# EasyEDA Pro project 1比87系列主控小板.epro

# Schematic 1比87系列主控小板
Create Date: 2023-08-22; Page Name: P1; Project Name: 遥控小车驱动小板; Schematic Name: 1比87系列主控小板; Update Date: 2023-08-26; Company: 嘉立创EDA; Page Size: A4; Version: V1.0
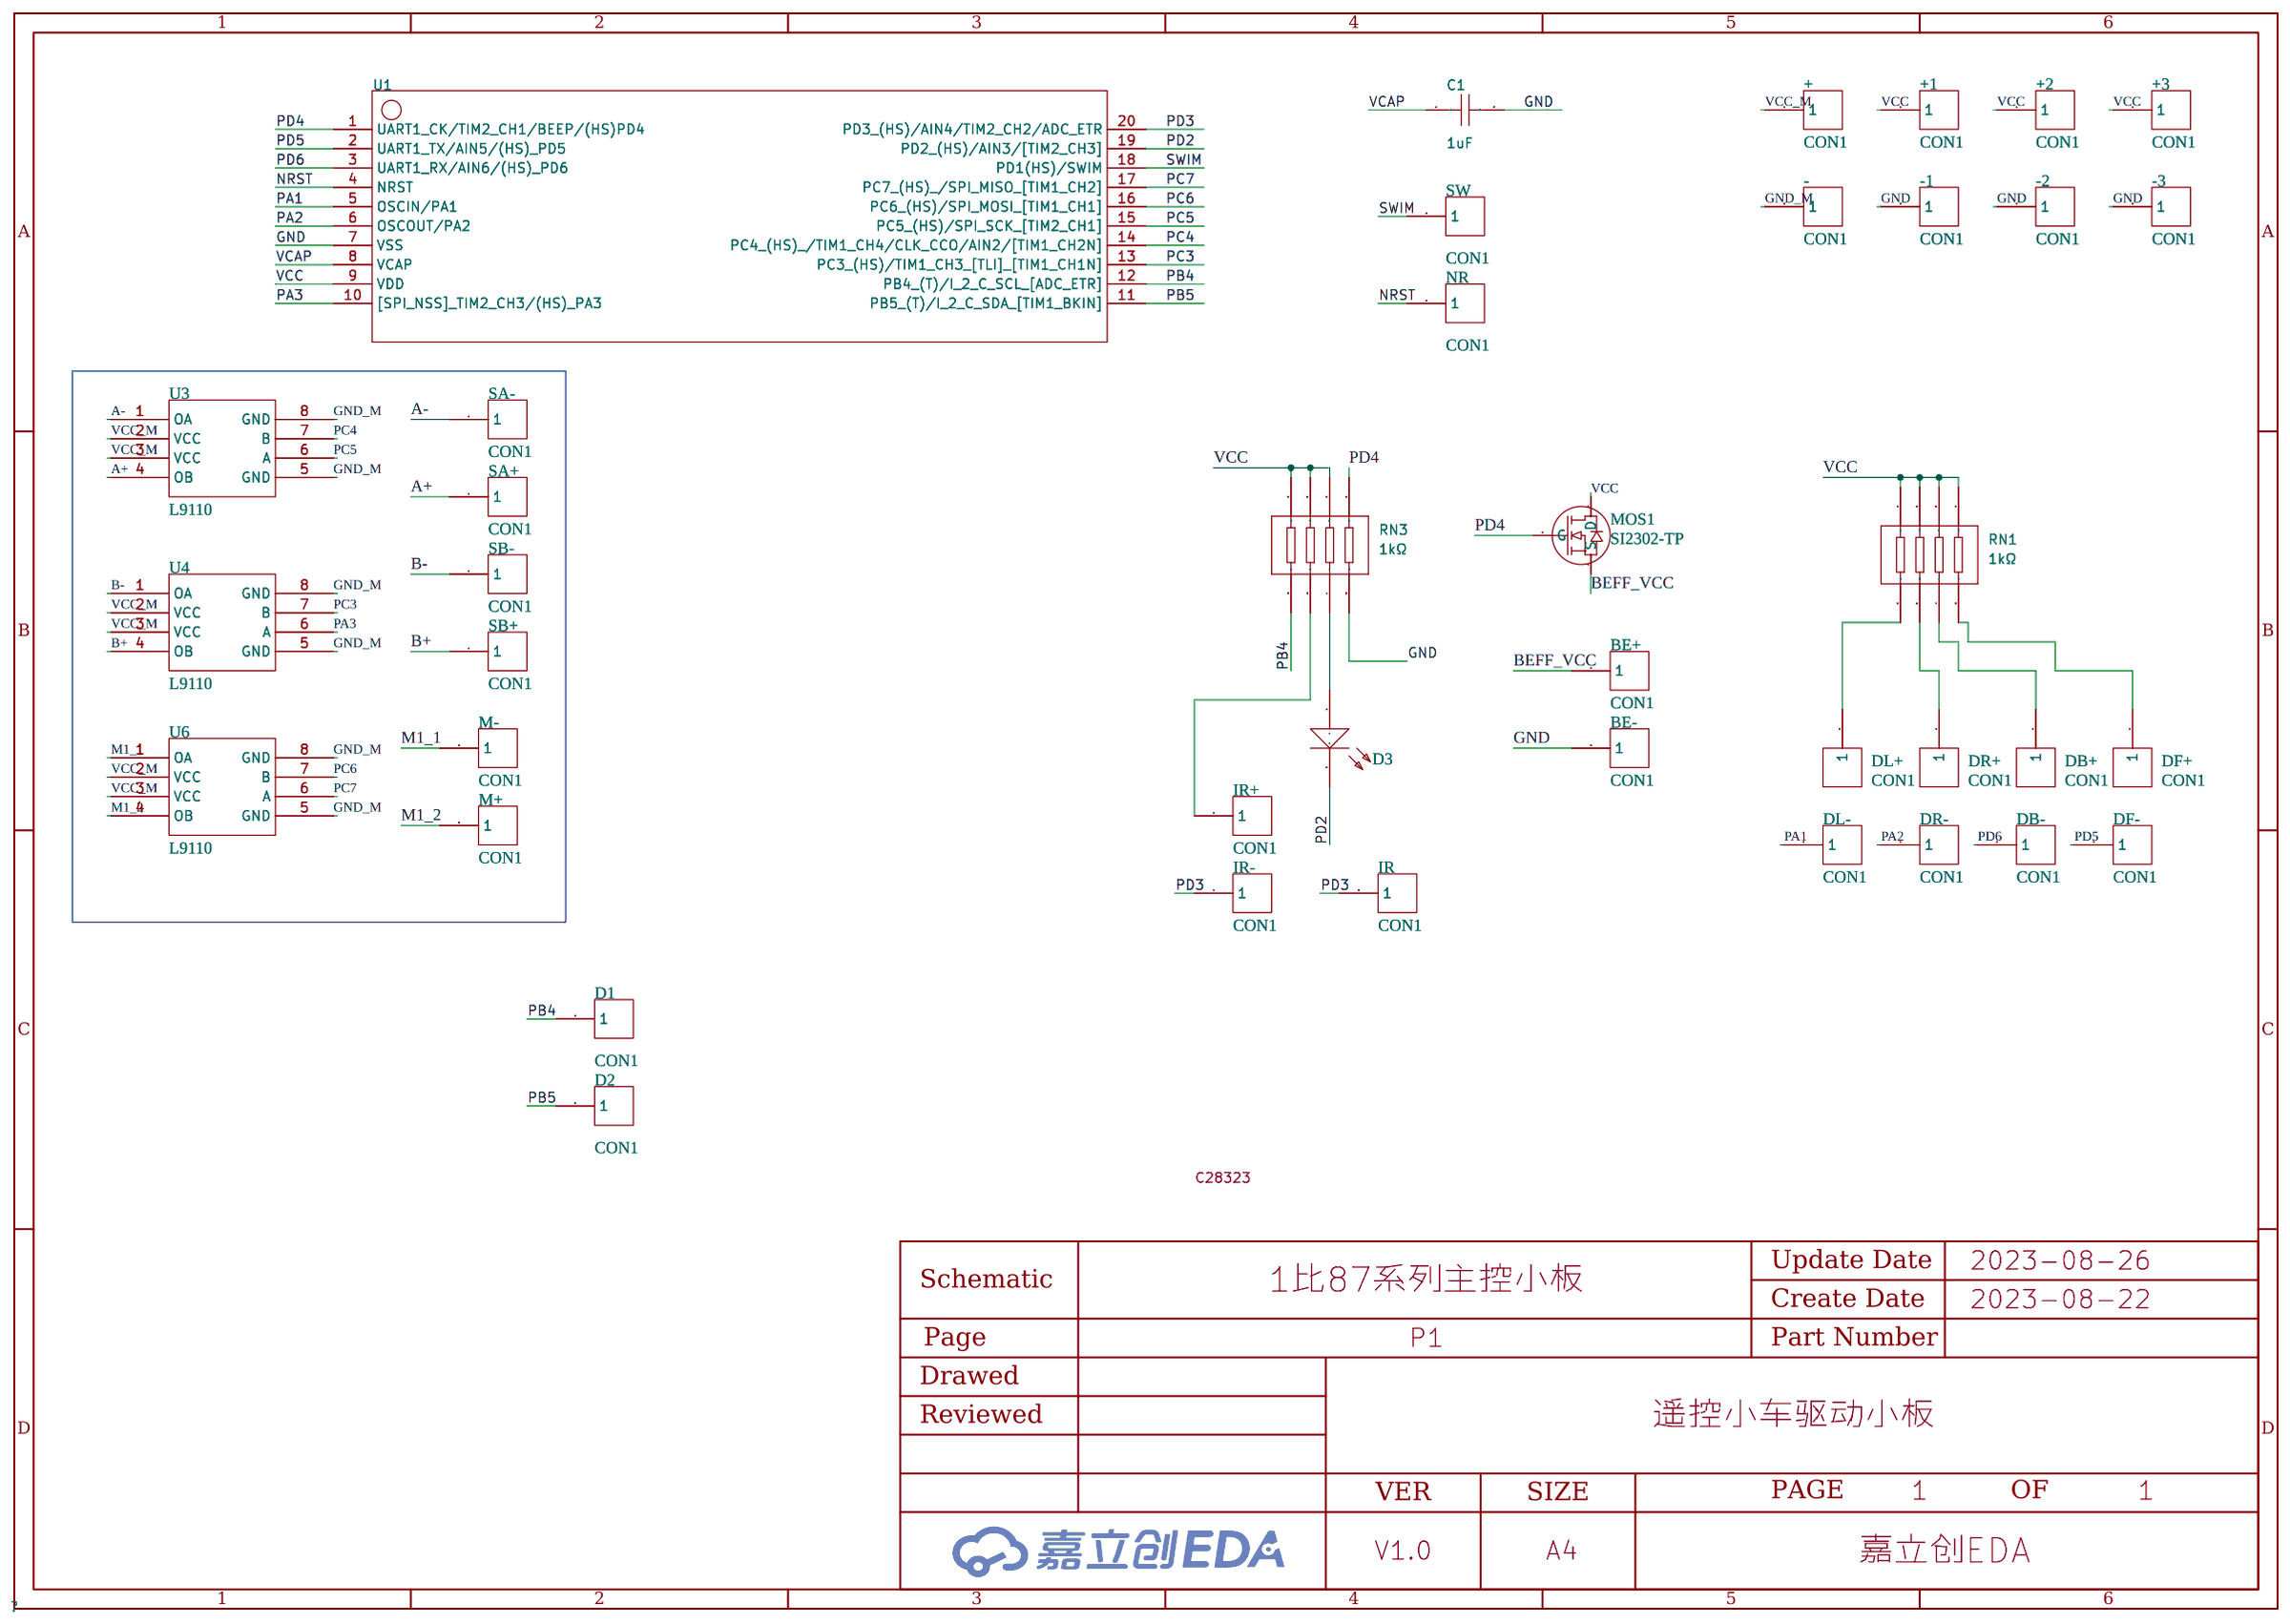
[diagram p0: schematic sheet]

## Parts
+  CON1  [CON1_2]
+1  CON1  [CON1_2]
+2  CON1  [CON1_2]
+3  CON1  [CON1_2]
-  CON1  [CON1_2]
-1  CON1  [CON1_2]
-2  CON1  [CON1_2]
-3  CON1  [CON1_2]
BE+  CON1  [CON1_2]
BE-  CON1  [CON1_2]
C1  1uF  [C0805]
D1  CON1  [CON1_2]
D2  CON1  [CON1_2]
D3  LED0  [LED0805_BLUE-1]
DB+  CON1  [CON1_2]
DB-  CON1  [CON1_2]
DF+  CON1  [CON1_2]
DF-  CON1  [CON1_2]
DL+  CON1  [CON1_2]
DL-  CON1  [CON1_2]
DR+  CON1  [CON1_2]
DR-  CON1  [CON1_2]
IR  CON1  [CON1_2]
IR+  CON1  [CON1_2]
IR-  CON1  [CON1_2]
M+  CON1  [CON1_2]
M-  CON1  [CON1_2]
MOS1  SI2302-TP  [SOT-23_MCC]
NR  CON1  [CON1_2]
RN1  1kΩ  [RES-ARRAY-SMD_0603-8P-L3.2-W1.6-BL]
RN3  1kΩ  [RES-ARRAY-SMD_0603-8P-L3.2-W1.6-BL]
SA+  CON1  [CON1_2]
SA-  CON1  [CON1_2]
SB+  CON1  [CON1_2]
SB-  CON1  [CON1_2]
SW  CON1  [CON1_2]
U1  STM8S003F3P6  [TSSOP-20_L6.5-W4.4-P0.65-LS6.4-BL]
U3  L9110  [SOP8]
U4  L9110  [SOP8]
U6  L9110  [SOP8]

## Library data of the parts
+ +1-+3 - -1--3 BE+ BE- D1 D2 DB+ DB- DF+ DF- DL+ DL- DR+ DR- IR IR+ IR- M+ M- NR SA+ SA- SB+ SB- SW = CON1: Library Name: 杰梗原理图库
C1 = CL21B105KBFNNNE: 容值:1uF;精度:±10%;额定电压:50V;材质(温度系数):X7R;; LCSC Part Name: 1uF ±10% 50V; Supplier Part: C28323; Manufacturer: SAMSUNG(三星); Supplier Footprint: 0805; JLCPCB Part Class: Basic Part; Datasheet: https://atta.szlcsc.com/upload/public/pdf/source/20160103/1457707718219.pdf; Supplier: LCSC; Tolerance: ±10%; Voltage Rated: 50V; Temperature Coefficient: X7R
D3 = LED0: 发光二极管; Published: 8-Jun-2000; LatestRevisionDate: 08-Jul-2005; LatestRevisionNote: Mech Layer 1 removed.; PackageReference: LED-0; Publisher: Altium Limited; Origin Footprint 2: LED_A1; Origin Footprint 3: LED_A2; Origin Footprint 4: LED-3528; Origin Footprint 5: LED-1206; Origin Footprint 1: LED-0805; Library Name: fszhang
MOS1 = SI2302-TP: No Description Available; Copyright: Copyright (C) 2022 Ultra Librarian. All rights reserved.; Mfr_Name: MCC; Type: DEV
RN1 RN3 = 4D03WGJ0102T5E: 阻值:1kΩ;精度:±5%;单个元件功率:62.5mW;电阻器数:4;; LCSC Part Name: 1kΩ ±5%; Supplier Part: C20197; Manufacturer: UNI-ROYAL(厚声); Supplier Footprint: 0603x4; JLCPCB Part Class: 基础库; Datasheet: https://atta.szlcsc.com/upload/public/pdf/source/20170615/1497510986702.pdf; Supplier: LCSC; Tolerance: ±5%; Power(Watts): 62.5mW; Number of Resistors: 4; Number of Pins: 8; Temperature Coefficient: ±200ppm/℃
U1 = STM8S003F3P6: CPU内核:STM8;CPU最大主频:16MHz;程序存储容量:8KB;程序存储器类型:FLASH;RAM总容量:1KB;GPIO端口数量:16;; LCSC Part Name: STM8 16MHz; Supplier Part: C18615; Manufacturer: ST(意法半导体); Supplier Footprint: TSSOP-20; JLCPCB Part Class: Extended Part; Datasheet: https://atta.szlcsc.com/upload/public/pdf/source/20130903/1457706644298.pdf; Supplier: LCSC; CPU Core: STM8; CPU Maximum Speed: 16MHz; Operating Voltage Range: 2.95V~5.5V; Program Storage Size: 8KB; Program Memory Type: FLASH; RAM Size: 1KB; EEPROM: 8KB; GPIO Ports Number: 16; ADC (Bit): 10bit; Peripheral/Function: 看门狗；PWM; Watchdog: 有; Infrared Data Association: 有; Low-Voltage Detect: 有; Internal Oscillator: 有; Operating Temperature Range: 40℃~+85℃
U3 U4 U6 = L9110: Library Name: 杰梗原理图库

## Nets
GND: -1.1 -2.1 -3.1 BE-.1 C1.2 RN3.8 U1.7(VSS)
GND_M: -.1 U3.5(GND) U3.8(GND) U4.5(GND) U4.8(GND) U6.5(GND) U6.8(GND)
VCC: +1.1 +2.1 +3.1 MOS1.3(D) RN1.1 RN1.2 RN1.3 RN1.4 RN3.2 RN3.3 RN3.4 U1.9(VDD)
VCC_M: +.1 U3.2(VCC) U3.3(VCC) U4.2(VCC) U4.3(VCC) U6.2(VCC) U6.3(VCC)
A+: SA+.1 U3.4(OB)
A-: SA-.1 U3.1(OA)
B+: SB+.1 U4.4(OB)
B-: SB-.1 U4.1(OA)
BEFF_VCC: BE+.1 MOS1.2(S)
M1_1: M-.1 U6.1(OA)
M1_2: M+.1 U6.4(OB)
NRST: NR.1 U1.4(NRST)
PA1: DL-.1 U1.5(OSCIN/PA1)
PA2: DR-.1 U1.6(OSCOUT/PA2)
PA3: U1.10([SPI_NSS] TIM2_CH3/(HS) PA3) U4.6(A)
PB4: D1.1 RN3.5 U1.12(PB4 (T)/I 2 C_SCL [ADC_ETR])
PB5: D2.1 U1.11(PB5 (T)/I 2 C_SDA [TIM1_BKIN])
PC3: U1.13(PC3 (HS)/TIM1_CH3 [TLI] [TIM1_CH1N]) U4.7(B)
PC4: U1.14(PC4 (HS) /TIM1_CH4/CLK_CCO/AIN2/[TIM1_CH2N]) U3.7(B)
PC5: U1.15(PC5 (HS)/SPI_SCK [TIM2_CH1]) U3.6(A)
PC6: U1.16(PC6 (HS)/SPI_MOSI [TIM1_CH1]) U6.7(B)
PC7: U1.17(PC7 (HS) /SPI_MISO [TIM1_CH2]) U6.6(A)
PD2: D3.2(K) U1.19(PD2 (HS)/AIN3/[TIM2_CH3])
PD3: IR.1 IR-.1 U1.20(PD3 (HS)/AIN4/TIM2_CH2/ADC_ETR)
PD4: MOS1.1(G) RN3.1 U1.1(UART1_CK/TIM2_CH1/BEEP/(HS)PD4)
PD5: DF-.1 U1.2(UART1_TX/AIN5/(HS) PD5)
PD6: DB-.1 U1.3(UART1_RX/AIN6/(HS) PD6)
SWIM: SW.1 U1.18(PD1(HS)/SWIM)
VCAP: C1.1 U1.8(VCAP)
$1N1468: DL+.1 RN1.5
$1N1470: DB+.1 RN1.7
$1N1545: DR+.1 RN1.6
$1N1579: DF+.1 RN1.8
Net-(D3-1): D3.1(A) RN3.7
Net-(IR+-1): IR+.1 RN3.6

# Board 1比87系列主控小板
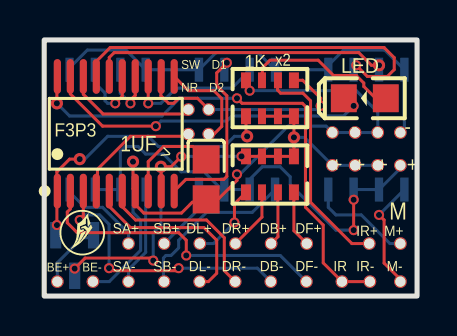
[diagram p1: board, top side]
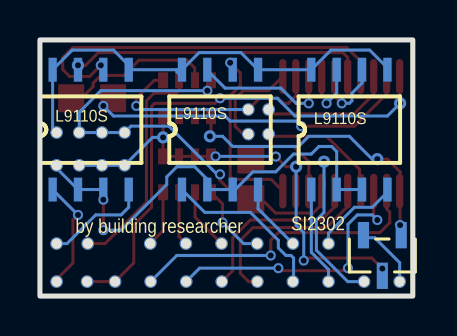
[diagram p2: board, bottom side, seen from below]

Outline 18.67 x 12.83 mm; copper layers: Top Layer, Bottom Layer. Coordinates in mm from the lower left corner of the outline.
Outline path: rectangle 0,12.83 18.67,0
Stack: Top Layer 0.035mm / Dielectric1 1.51mm FR4 er 4.5 / Bottom Layer 0.035mm

## Design rules (mm)
template: 自定义配置
spacing copperThickness1oz (default): track to track 0.102, other pairs 0.152 to 0.3
spacing copperThickness2oz: track to track 0.203, other pairs 0.152 to 0.3
track width copperThickness1oz (default): min 0.127, default 0.152, max 2.54
track width copperThickness2oz: min 0.203, default 0.254, max 2.54
differential pair differentialPair (default): width min 0.127, default 0.254, max 2.54; gap min 0.152, default 0.152
via viaSize (default): diameter min 0.5, default 0.61, max 10; hole min 0.3, default 0.305, max 6.299

## Placement (name value [footprint] x y rotation side)
1K  1kΩ  [RES-ARRAY-SMD_0603-8P-L3.2-W1.6-BL]  11.3 9.91 0 top
+  CON1  [CON1_2]  15.56 6.55 180 top
+#2  -  [CON1_2]  14.43 6.55 180 top
+#3  -  [CON1_2]  17.84 6.55 180 top
+#4  -  [CON1_2]  16.7 6.55 180 top
-  CON1  [CON1_2]  16.7 8.19 180 top
-#2  -  [CON1_2]  15.56 8.19 180 top
-#3  -  [CON1_2]  14.43 8.19 180 top
-#4  -  [CON1_2]  17.84 8.19 180 top
>  1uF  [C0805]  8.11 5.84 270 top
BE+  CON1  [CON1_2]  0.66 0.72 0 top
BE-  CON1  [CON1_2]  2.44 0.72 0 top
D1  CON1  [CON1_2]  8.24 9.34 0 top
D2  CON1  [CON1_2]  8.24 8.11 0 top
DB+  CON1  [CON1_2]  11.36 2.63 0 top
DB-  CON1  [CON1_2]  11.34 0.72 0 top
DF+  CON1  [CON1_2]  13.15 2.63 0 top
DF-  CON1  [CON1_2]  13.13 0.72 0 top
DL+  CON1  [CON1_2]  7.79 2.63 0 top
DL-  CON1  [CON1_2]  7.78 0.72 0 top
DR+  CON1  [CON1_2]  9.58 2.63 0 top
DR-  CON1  [CON1_2]  9.56 0.72 0 top
F3P3  STM8S003F3P6  [TSSOP-20_L6.5-W4.4-P0.65-LS6.4-BL]  3.58 8.13 0 top
IR  CON1  [CON1_2]  14.91 0.72 0 top
IR+  CON1  [CON1_2]  16.28 2.63 0 top
IR-  CON1  [CON1_2]  16.31 0.72 0 top
L9110S  -  [SOP8]  11.56 5.33 90 bottom
L9110S#2  -  [SOP8]  18.03 5.33 90 bottom
L9110S#3  -  [SOP8]  5.08 5.33 90 bottom
LED  LED0  [LED0805_BLUE-1]  16.05 9.91 180 top
M+  CON1  [CON1_2]  17.84 2.63 0 top
M-  CON1  [CON1_2]  17.84 0.72 0 top
MOS1  SI2302-TP  [SOT-23_MCC]  1.52 2.03 0 bottom
NR  CON1  [CON1_2]  7.22 8.11 0 top
RN1  1kΩ  [RES-ARRAY-SMD_0603-8P-L3.2-W1.6-BL]  11.3 6.1 180 top
SA+  CON1  [CON1_2]  4.22 2.63 0 top
SA-  CON1  [CON1_2]  4.22 0.72 0 top
SB+  CON1  [CON1_2]  6 2.63 0 top
SB-  CON1  [CON1_2]  6 0.72 0 top
SW  CON1  [CON1_2]  7.22 9.34 0 top

## Footprints (pads in the part's own frame, mm; a bottom-side part is the same pattern mirrored in y, then rotated)
C0805
  rect 1.41x1.35 smd: 1(-1,0) 2(1,0)
CON1_2
  round 0.635 hole 0.508: 1(0,0)
LED0805_BLUE-1
  rect 1.3x1.399 smd: 1(-1.05,0) 2(1.05,0)
RES-ARRAY-SMD_0603-8P-L3.2-W1.6-BL
  rect 0.5x0.8 smd: 1(-1.2,-0.9) 4(1.2,-0.9) 5(1.2,0.9) 8(-1.2,0.9)
  rect 0.4x0.8 smd: 2(-0.4,-0.9) 3(0.4,-0.9) 6(0.4,0.9) 7(-0.4,0.9)
SOP8
  rect 1.2x0.42 smd: 1(0,0) 2(0,-1.27) 3(0,-2.54) 4(0,-3.81) 5(6,-3.81) 6(6,-2.54) 7(6,-1.27) 8(6,0)
SOT-23_MCC
  rect 0.559x1.321 smd: 1(-0.946,-1.016) 2(0.946,-1.016) 3(0,1.016)
TSSOP-20_L6.5-W4.4-P0.65-LS6.4-BL
  oval 0.364x1.742 smd: 1(-2.925,-2.871) 2(-2.275,-2.871) 3(-1.625,-2.871) 4(-0.975,-2.871) 5(-0.325,-2.871) 6(0.325,-2.871) 7(0.975,-2.871) 8(1.625,-2.871) 9(2.275,-2.871) 10(2.925,-2.871) 11(2.925,2.871) 12(2.275,2.871) 13(1.625,2.871) 14(0.975,2.871) 15(0.325,2.871) 16(-0.325,2.871) 17(-0.975,2.871) 18(-1.625,2.871) 19(-2.275,2.871) 20(-2.925,2.871)

## Nets
GND: 1K.8 -.1 -#2.1 -#3.1 >.2 BE-.1 F3P3.7
GND_M: -#4.1 L9110S.5 L9110S.8 L9110S#2.5 L9110S#2.8 L9110S#3.5 L9110S#3.8
VCC: 1K.2 1K.3 1K.4 +.1 +#2.1 +#4.1 F3P3.9 MOS1.3 RN1.1 RN1.2 RN1.3 RN1.4
VCC_M: +#3.1 L9110S.2 L9110S.3 L9110S#2.2 L9110S#2.3 L9110S#3.2 L9110S#3.3
A+: L9110S#3.4 SA+.1
A-: L9110S#3.1 SA-.1
B+: L9110S.4 SB+.1
B-: L9110S.1 SB-.1
BEFF_VCC: BE+.1 MOS1.2
M1_1: L9110S#2.1 M-.1
M1_2: L9110S#2.4 M+.1
NRST: F3P3.4 NR.1
PA1: DL-.1 F3P3.5
PA2: DR-.1 F3P3.6
PA3: F3P3.10 L9110S.6
PB4: 1K.5 D1.1 F3P3.12
PB5: D2.1 F3P3.11
PC3: F3P3.13 L9110S.7
PC4: F3P3.14 L9110S#3.7
PC5: F3P3.15 L9110S#3.6
PC6: F3P3.16 L9110S#2.7
PC7: F3P3.17 L9110S#2.6
PD2: F3P3.19 LED.2
PD3: F3P3.20 IR.1 IR-.1
PD4: 1K.1 F3P3.1 MOS1.1
PD5: DF-.1 F3P3.2
PD6: DB-.1 F3P3.3
SWIM: F3P3.18 SW.1
VCAP: >.1 F3P3.8
$1N1468: DL+.1 RN1.5
$1N1470: DB+.1 RN1.7
$1N1545: DR+.1 RN1.6
$1N1579: DF+.1 RN1.8
$1N1996: 1K.7 LED.1
$1N2008: 1K.6 IR+.1

## Via types
v1: diameter 0.508, hole 0.305, Top Layer to Bottom Layer, 24 vias
v2: diameter 0.61, hole 0.305, Top Layer to Bottom Layer, 7 vias

## Routing (per net, layer and track width the routed paths; a pad name or vN(x,y) marks a point on that pad's centre or on a via; arc(x,y) is an arc through that point)
GND: length 31.3
  Top Layer w0.152: v1(9.65,6.1) 9.65,5.79 8.56,4.7 7.41,4.7 6.87,4.16 4.99,4.16 4.7,4.45 ; F3P3.7 4.45,5.37 v2(4.45,6.73)
  Bottom Layer w0.152: BE-.1 3.26,0.72 4.83,2.29 4.83,3.81 4.45,4.19 v2(4.45,6.73) ; v1(10.29,10.29) 15.62,10.29 16.7,9.21 -.1 -#2.1 -#3.1 14.11,8.51 12.21,8.51 9.8,6.1 v1(9.65,6.1)
GND_M: length 22.5
  Bottom Layer w0.152: L9110S#3.5 1.27,11.43 2.16,12.32 4.09,12.32 L9110S#3.8 L9110S.5 8.61,12.19 10.7,12.19 L9110S.8 ; 11.74,11.15 11.81,11.23 11.81,11.33 L9110S#2.5 14.22,11.56 14.99,12.32 17.05,12.32 L9110S#2.8 18.03,8.39 -#4.1
VCC: length 25.3
  Top Layer w0.152: F3P3.9 5.86,6.46 v2(5.84,6.48) 6.35,6.48 v1(6.86,6.98) ; 1K.2 1K.3 1K.4 v2(12.5,7.95) 12.5,7 ; RN1.1 RN1.2 RN1.3 RN1.4 ; v1(1.52,1.38) 2.05,1.91 5.33,1.91 v1(5.46,1.78)
  Bottom Layer w0.152: v2(12.5,7.95) 13.03,7.95 +#2.1 +.1 +#4.1 ; v1(6.86,6.98) 6.87,7 v1(9.88,7) ; v1(5.46,1.78) 5.46,1.78 5.46,3.17 5.84,3.56 v2(5.84,6.48)
VCC_M: length 22.6
  Top Layer w0.152: v1(15.49,3.3) v1(15.49,4.83)
  Bottom Layer w0.152: L9110S#3.3 L9110S#3.2 3.81,7.24 4.06,7.49 4.7,7.49 5.08,7.11 5.97,7.11 6.86,6.22 8,6.22 8.89,5.33 L9110S.3 L9110S.2 10.29,5.84 10.92,6.48 11.81,6.48 12.32,5.97 12.32,5.59 14.61,3.3 v1(15.49,3.3) ; +#3.1 17.84,6.41 L9110S#2.2 L9110S#2.3
A+: length 4.4
  Bottom Layer w0.152: SA+.1 4.22,3.15 2.92,4.45 2.03,4.45 1.27,5.21 L9110S#3.4
A-: length 5
  Bottom Layer w0.152: L9110S#3.1 5.08,2.19 4.22,1.33 SA-.1
B+: length 3.4
  Bottom Layer w0.152: L9110S.4 7.75,4.37 SB+.1
B-: length 8.4
  Bottom Layer w0.152: SB-.1 5.97,0.76 5.97,1.91 6.1,2.03 6.35,2.03 6.73,2.41 6.73,2.79 8.13,4.19 10.41,4.19 L9110S.1
BEFF_VCC: length 3.3
  Bottom Layer w0.152: 2.47,2.92 1.91,2.92 0.66,1.67 BE+.1
M1_1: length 5.6
  Top Layer w0.152: M-.1 17.84,0.83 17.02,1.65 17.02,3.81 v1(16.76,4.06)
  Bottom Layer w0.152: v1(16.76,4.06) L9110S#2.1
M1_2: length 5.3
  Bottom Layer w0.152: M+.1 17.31,2.63 15.88,4.06 14.61,4.06 14.22,4.45 L9110S#2.4
NRST: length 6.7
  Top Layer w0.152: 7.47,8.11 7.36,8 4.32,8 2.67,6.35 2.67,5.32 F3P3.4
PA1: length 9.5
  Top Layer w0.152: F3P3.5 3.26,4.49 4.32,3.43 8,3.43 8.64,2.79 8.64,1.14 8.22,0.72 DL-.1
PA2: length 9
  Top Layer w0.152: F3P3.6 3.91,4.47 4.57,3.81 8.13,3.81 9.02,2.92 9.02,1.27 DR-.1
PA3: length 9.1
  Top Layer w0.152: F3P3.10 7.09,5.84 8.99,5.84 9.14,5.99 9.14,10.03 8.64,10.54 8.64,11.18 v1(9.14,11.68)
PB4: length 11.8
  Top Layer w0.152: D1.1 7.67,9.91 6.73,9.91 6.48,9.65 6.22,9.65 5.84,10.03 5.84,10.98 5.86,11 ; 1K.5 12.94,10.81 13.84,9.91 v1(13.84,9.53)
  Bottom Layer w0.152: v1(13.84,9.53) 13.66,9.34 8.11,9.34
PB5: length 5.2
  Top Layer w0.152: 6.51,11 7.22,10.29 8.49,10.29 8.89,9.89 8.89,8.5 8.5,8.11 8.11,8.11
PC3: length 7.1
  Top Layer w0.152: v1(5.21,9.65) 5.21,11
  Bottom Layer w0.152: v1(5.21,9.65) 5.84,9.65 6.6,10.41 9.4,10.41 10.29,11.3 L9110S.7
PC4: length 3.3
  Top Layer w0.152: 4.56,11 4.56,10.05 4.32,9.81 v1(4.32,9.65)
  Bottom Layer w0.152: v1(4.32,9.65) 3.81,10.16 L9110S#3.7
PC5: length 3.8
  Top Layer w0.152: 3.91,11 3.91,10 v1(3.56,9.65)
  Bottom Layer w0.152: L9110S#3.6 2.54,10.67 3.05,10.16 3.05,9.78 3.18,9.65 v1(3.56,9.65)
PC6: length 14.8
  Top Layer w0.152: 3.26,11 3.26,11.95 3.5,12.19 15.75,12.19 16.38,11.56 v2(16.76,11.56)
PC7: length 19
  Top Layer w0.152: v1(15.62,11.56) 16.18,11 17.18,11 17.53,11.34 17.53,11.94 17.02,12.45 3.3,12.45 2.61,11.75 2.61,11
PD2: length 16.2
  Top Layer w0.152: 5.46,8.64 5.46,8.51 2.92,8.51 1.31,10.12 1.31,11
  Bottom Layer w0.152: v1(15.49,9.53) 14.99,9.02 9.4,9.02 9.14,8.76 5.84,8.76 v1(5.59,8.51)
PD3: length 25.5
  Top Layer w0.152: 0.66,11 0.64,10.98 v2(0.64,9.65) ; v1(9.65,9.91) 9.91,9.65 12.93,9.65 13.08,9.5 13.08,4.45 13.97,3.56 13.97,1.66 IR.1 IR-.1
  Bottom Layer w0.152: v2(0.64,9.65) 1.27,9.02 5.9,9.02 6.78,9.91 v1(9.65,9.91)
PD4: length 14.4
  Top Layer w0.152: v2(10.16,8) 10.1,8.06 1K.1 ; v2(1.78,6.86) 1.27,6.86 0.64,6.22 0.64,5.28 F3P3.1 0.64,5.23 v1(0.64,3.56)
  Bottom Layer w0.152: v2(1.78,6.86) 2.03,6.86 3.18,8 5.21,8 5.72,7.49 9.02,7.49 9.53,8 v2(10.16,8)
PD5: length 15.3
  Top Layer w0.152: F3P3.2 1.31,4.36 1.16,4.21 1.16,3.67 1.65,3.17 6.73,3.17 7.11,2.79 v1(7.11,2.03)
  Bottom Layer w0.152: DF-.1 11.82,2.03 v1(7.11,2.03)
PD6: length 14
  Top Layer w0.152: v1(3.25,1.4) 3.37,1.27 6.6,1.27 v1(6.73,1.4) ; v1(1.78,3.81) 1.96,3.99 F3P3.3
  Bottom Layer w0.152: v1(1.78,3.81) 2.03,4.06 2.78,4.06 3.25,3.59 v1(3.25,1.4) ; DB-.1 10.67,1.4 v1(6.73,1.4)
SWIM: length 6.8
  Top Layer w0.152: SW.1 7.22,9.12 2.95,9.12 1.96,10.11 1.96,11
VCAP: length 5
  Top Layer w0.152: 5.21,5.26 5.21,6.73 5.97,7.49 7.45,7.49 8.13,6.81
$1N1468: length 3.9
  Top Layer w0.152: v1(9.53,3.68) 9.53,4.62 RN1.5
  Bottom Layer w0.152: DL+.1 8.47,2.63 v1(9.53,3.68)
$1N1470: length 2.7
  Top Layer w0.152: RN1.7 11.7,2.97 DB+.1
$1N1545: length 3.1
  Top Layer w0.152: DR+.1 10.9,3.96 RN1.6
$1N1579: length 2.8
  Top Layer w0.152: RN1.8 12.5,3.27 DF+.1
$1N1996: length 8
  Top Layer w0.152: 1K.7 10.92,10.82 10.92,11.43 11.3,11.81 13.72,11.81 14.48,11.05 15.62,11.05 16,10.67 16,10.5 17.02,9.47
$1N2008: length 11.3
  Top Layer w0.152: IR+.1 15.41,2.63 13.34,4.7 13.34,9.78 12.95,10.16 11.84,10.16 11.68,10.31 11.68,10.79 1K.6

## Text on the board
Bottom Silkscreen Layer: SI2302 | by building researcher
Top Silkscreen Layer: x2 | 1UF | M
